# Altium schematic sheet Controller.SchDoc
size OrCAD A; SheetNumber: 4; SheetTotal: 4
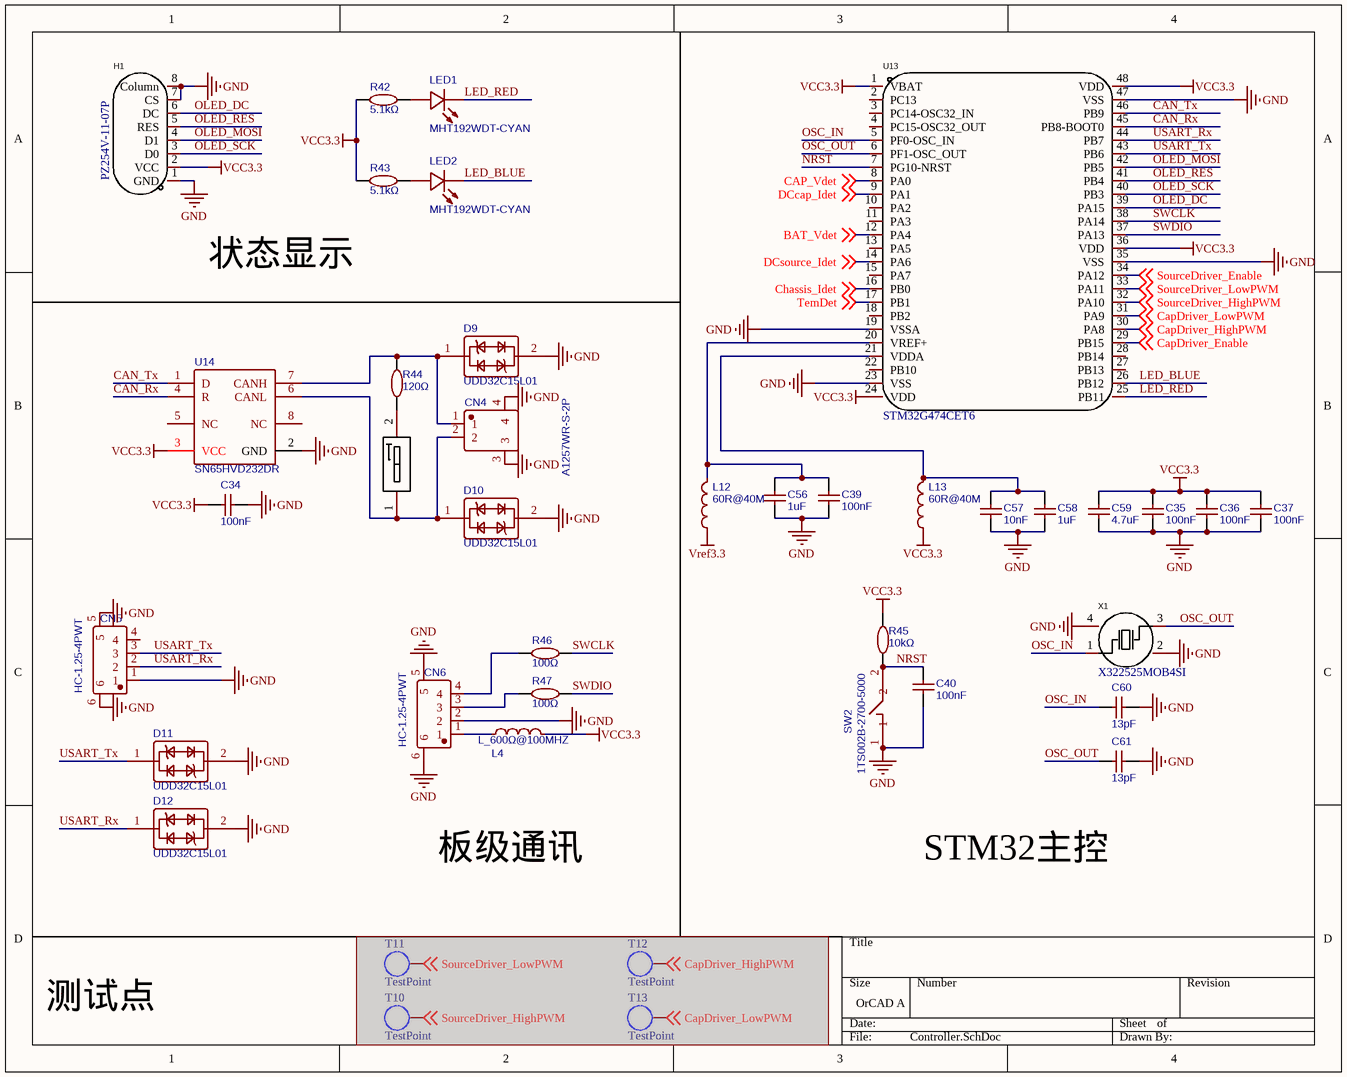
[diagram p0: Controller.SchDoc]

## Parts
C34  100nF  [C-RAD-0603]
C35  100nF  [C-RAD-0603]
C36  100nF  [C-RAD-0603]
C37  100nF  [C-RAD-0603]
C39  100nF  [C-RAD-0603]
C40  100nF  [C-RAD-0603]
C56  1uF  [C-RAD-0603]
C57  10nF  [C-RAD-0603]
C58  1uF  [C-RAD-0603]
C59  4.7uF  [C-RAD-0805]
C60  13pF  [C-RAD-0603]
C61  13pF  [C-RAD-0603]
CN4  A1257WR-S-2P  [CONN-SMD_A1257WR-S-2P]
CN5  HC-1.25-4PWT  [CONN-SMD_4P-P1.25-HC-1.25-4PWT]
CN6  HC-1.25-4PWT  [CONN-SMD_4P-P1.25-HC-1.25-4PWT]
D9  UDD32C15L01  [SOD-323_L1.8-W1.3-LS2.5-BI]
D10  UDD32C15L01  [SOD-323_L1.8-W1.3-LS2.5-BI]
D11  UDD32C15L01  [SOD-323_L1.8-W1.3-LS2.5-BI]
D12  UDD32C15L01  [SOD-323_L1.8-W1.3-LS2.5-BI]
H1  PZ254V-11-07P  [OLED_13inch]
L4  L_600Ω@100MHZ  [0805-1]
L12  60R@40M  [0603-1]
L13  60R@40M  [0603-1]
LED1  MHT192WDT-CYAN  [LED_0805]
LED2  MHT192WDT-CYAN  [LED_0805]
R42  5.1kΩ  [0603-1]
R43  5.1kΩ  [0603-1]
R44  120Ω  [0603-1]
R45  10kΩ  [0603-1]
R46  100Ω  [0603-1]
R47  100Ω  [0603-1]
SW1  DSHP01TSGET  [SW-SMD_DSHP01TSGET]  (value not drawn)
SW2  1TS002B-2700-5000  [SW_PB2_A1]
T10  TestPoint  [TestPoint]  (masked out: inside a compile mask, not in the netlist)
T11  TestPoint  [TestPoint]  (masked out: inside a compile mask, not in the netlist)
T12  TestPoint  [TestPoint]  (masked out: inside a compile mask, not in the netlist)
T13  TestPoint  [TestPoint]  (masked out: inside a compile mask, not in the netlist)
U13  STM32G474CET6  [LQFP-48_M]
U14  SN65HVD232DR  [SOIC127P610X175-8N]
X1  X322525MOB4SI  [OSC-3225]

## Nets
GND: C34.1 C35.1 C36.1 C37.1 C39.1 C40.1 C56.1 C57.1 C58.1 C59.1 C60.2 C61.2 CN4.3 CN4.4 CN5.1 CN5.5 CN5.6 CN6.2 CN6.5 CN6.6 D9.2 D10.2 D11.2 D12.2 H1.1(GND) H1.7(CS) H1.8(Column) SW2.1 U13.19(VSSA) U13.23(VSS) U13.35(VSS) U13.47(VSS) U14.2(GND) X1.2(GND) X1.4(GND)
VCC3.3: C34.2 C35.2 C36.2 C37.2 C59.2 H1.2(VCC) L4.2 L13.1 R42.2 R43.2 R45.2 U13.1(VBAT) U13.24(VDD) U13.36(VDD) U13.48(VDD) U14.3(VCC)
Vref3.3: L12.1
BAT_Vdet: U13.12(PA4) ; off-sheet BAT_Vdet
CAN_Rx: U13.45(PB8-BOOT0) U14.4(R)
CAN_Tx: U13.46(PB9) U14.1(D)
CAP_Vdet: U13.8(PA0) ; off-sheet CAP_Vdet
CapDriver_Enable: U13.29(PB15) ; off-sheet CapDriver_Enable
CapDriver_HighPWM: U13.30(PA8) ; off-sheet CapDriver_HighPWM
CapDriver_LowPWM: U13.31(PA9) ; off-sheet CapDriver_LowPWM
Chassis_Idet: U13.16(PB0) ; off-sheet Chassis_Idet
DCcap_Idet: U13.9(PA1) ; off-sheet DCcap_Idet
DCsource_Idet: U13.14(PA6) ; off-sheet DCsource_Idet
LED_BLUE: LED2.2(K) U13.26(PB12)
LED_RED: LED1.2(K) U13.25(PB11)
NRST: C40.2 R45.1 SW2.2 U13.7(PG10-NRST)
OLED_DC: H1.6(DC) U13.39(PA15)
OLED_MOSI: H1.4(D1) U13.42(PB5)
OLED_RES: H1.5(RES) U13.41(PB4)
OLED_SCK: H1.3(D0) U13.40(PB3)
OSC_IN: C60.1 U13.5(PF0-OSC_IN) X1.1(OSC1)
OSC_OUT: C61.1 U13.6(PF1-OSC_OUT) X1.3(OSC2)
SourceDriver_Enable: U13.34(PA12) ; off-sheet SourceDriver_Enable
SourceDriver_HighPWM: U13.32(PA10) ; off-sheet SourceDriver_HighPWM
SourceDriver_LowPWM: U13.33(PA11) ; off-sheet SourceDriver_LowPWM
SWCLK: R46.2 U13.38(PA14)
SWDIO: R47.2 U13.37(PA13)
TemDet: U13.17(PB1) ; off-sheet TemDet
USART_Rx: CN5.2 D12.1 U13.44(PB7)
USART_Tx: CN5.3 D11.1 U13.43(PB6)
NetC39_2: C39.2 C56.2 L12.2 U13.20(VREF+)
NetC57_2: C57.2 C58.2 L13.2 U13.21(VDDA)
NetCN4_1: CN4.1 D9.1 R44.2 U14.7(CANH)
NetCN4_2: CN4.2 D10.1 SW1.1(A1) U14.6(CANL)
NetCN6_1: CN6.1 L4.1
NetCN6_3: CN6.3 R47.1
NetCN6_4: CN6.4 R46.1
NetLED1_1: LED1.1(A) R42.1
NetLED2_1: LED2.1(A) R43.1
NetR44_1: R44.1 SW1.2(B1)

Not connected (* = marked no-connect by the designer): CN5 4; U13 2(PC13) 3(PC14-OSC32_IN) 4(PC15-OSC32_OUT) 10(PA2) 11(PA3) 13(PA5) 15(PA7) 18(PB2) 22(PB10) 27(PB13) 28(PB14); U14 5(NC) 8(NC)

## Notes on the sheet
- 状态显示
- 板级通讯
- STM32主控
- 测试点

## Library data of the parts
C34-C37 C39 C40 = 100nF: BOM_Manufacturer: Guangdong Fenghua Advanced Tech; BOM_Manufacturer Part: 0805CG330J500NT; nameAlias: Capacitance; Contributor: LCSC; BOM_Supplier: LCSC; BOM_Supplier Part: C157687; BOM_JLCPCB Part Class: Extended Part; spicePre: C; spiceSymbolName: 0805CG330J500NT
C56 C58 = 1uF: BOM_Manufacturer: Guangdong Fenghua Advanced Tech; BOM_Manufacturer Part: 0805CG330J500NT; nameAlias: Capacitance; Contributor: LCSC; BOM_Supplier: LCSC; BOM_Supplier Part: C157687; BOM_JLCPCB Part Class: Extended Part; spicePre: C; spiceSymbolName: 0805CG330J500NT
C57 = 10nF: BOM_Manufacturer: Guangdong Fenghua Advanced Tech; BOM_Manufacturer Part: 0805CG330J500NT; nameAlias: Capacitance; Contributor: LCSC; BOM_Supplier: LCSC; BOM_Supplier Part: C157687; BOM_JLCPCB Part Class: Extended Part; spicePre: C; spiceSymbolName: 0805CG330J500NT
C59 = 4.7uF: BOM_Manufacturer: Guangdong Fenghua Advanced Tech; BOM_Manufacturer Part: 0805CG330J500NT; nameAlias: Capacitance; Contributor: LCSC; BOM_Supplier: LCSC; BOM_Supplier Part: C157687; BOM_JLCPCB Part Class: Extended Part; spicePre: C; spiceSymbolName: 0805CG330J500NT
C60 C61 = 13pF: BOM_Manufacturer: Guangdong Fenghua Advanced Tech; BOM_Manufacturer Part: 0805CG330J500NT; nameAlias: Capacitance; Contributor: LCSC; BOM_Supplier: LCSC; BOM_Supplier Part: C157687; BOM_JLCPCB Part Class: Extended Part; spicePre: C; spiceSymbolName: 0805CG330J500NT
CN4 = A1257WR-S-2P: BOM_Manufacturer: Changjiang Connectors; Contributor: LCSC; BOM_Supplier: LCSC; BOM_Supplier Part: C225125; BOM_Manufacturer Part: A1257WR-S-2P; BOM_JLCPCB Part Class: Extended Part; spicePre: C; spiceSymbolName: A1257WR-S-2P
CN5 CN6 = HC-1.25-4PWT: BOM_Manufacturer: HCTL(华灿天禄); Contributor: LCSC; BOM_Supplier: LCSC; BOM_Supplier Part: C2845381; BOM_Manufacturer Part: HC-1.25-4PWT; BOM_JLCPCB Part Class: Extended Part; spicePre: C; spiceSymbolName: HC-1.25-4PWT
D9-D12 = UDD32C15L01: BOM_Manufacturer: Brightking Elec (TAIWAN); Contributor: LCSC; BOM_Supplier: LCSC; BOM_Supplier Part: C313321; BOM_Manufacturer Part: UDD32C15L01; BOM_JLCPCB Part Class: Extended Part; spicePre: D; spiceSymbolName: UDD32C15L01
H1 = OLED_1.3inch: Manufacturer: XFCN(兴飞); Add into BOM: yes; Pitch: 2.54mm; Pin Structure: 1x7P; Circluar Pins/Square Pins: 方针; Name: PZ254V-11-07P; Symbol: PZ254V-11-07P; Device: PZ254V-11-07P; LCSC Part Name: 2.54mm 1x7P 直插 方针; Supplier Part: C492406; Manufacturer Part: PZ254V-11-07P; Supplier Footprint: 直插,P=2.54mm; JLCPCB Part Class: Extended Part; Datasheet: https://atta.szlcsc.com/upload/public/pdf/source/20200309/C492406_654C533EE691117E22DD9F76C114C2D9.pdf; Supplier: LCSC; Convert to PCB: yes; Number of Pins: 7; Number of Rows: 1; Row Spacing: -; Mounting Type: 直插; Current Rating (Max): -; Voltage Rating (Max): -; Length of Mating Pin: 6mm; Insulation Height: 2.5mm; Length of End Connection Pin: 3mm; Contact Material: 黄铜; Contact Plating: -; Operating Temperature Range: -40℃~+105℃; Color: 黑色
L4 = L_600Ω@100MHZ: BOM_Manufacturer: FH; BOM_Manufacturer Part: CBW201209U601T; nameAlias: Value; BOM_Supplier: LCSC; BOM_Supplier Part: C21286; BOM_JLCPCB Part Class: Extended Part; spicePre: L; spiceSymbolName: CBW201209U601T
L12 L13 = 60R@40M: BOM_Manufacturer: FH; BOM_Manufacturer Part: CBW201209U601T; nameAlias: Value; BOM_Supplier: LCSC; BOM_Supplier Part: C21286; BOM_JLCPCB Part Class: Extended Part; spicePre: L; spiceSymbolName: CBW201209U601T
LED1 LED2 = MHT192WDT-CYAN: BOM_Manufacturer: MEIHUA; Contributor: LCSC; BOM_Supplier: LCSC; BOM_Supplier Part: C496821; BOM_Manufacturer Part: MHT192WDT-CYAN; BOM_JLCPCB Part Class: Extended Part; spicePre: L; spiceSymbolName: MHT192WDT-CYAN
R42 R43 = 5.1kΩ: BOM_Manufacturer: UniOhm; BOM_Manufacturer Part: 0603WAF1002T5E; nameAlias: Resistance; Resistance (Ohms): 10K; BOM_Supplier: LCSC; BOM_Supplier Part: C25804; BOM_JLCPCB Part Class: Basic Part; spicePre: R; spiceSymbolName: 0603WAF1002T5E
R44 = 120Ω: BOM_Manufacturer: UniOhm; BOM_Manufacturer Part: 0603WAF1002T5E; nameAlias: Resistance; Resistance (Ohms): 10K; BOM_Supplier: LCSC; BOM_Supplier Part: C25804; BOM_JLCPCB Part Class: Basic Part; spicePre: R; spiceSymbolName: 0603WAF1002T5E
R45 = 10kΩ: BOM_Manufacturer: UniOhm; BOM_Manufacturer Part: 0603WAF1002T5E; nameAlias: Resistance; Resistance (Ohms): 10K; BOM_Supplier: LCSC; BOM_Supplier Part: C25804; BOM_JLCPCB Part Class: Basic Part; spicePre: R; spiceSymbolName: 0603WAF1002T5E
R46 R47 = 100Ω: BOM_Manufacturer: UniOhm; BOM_Manufacturer Part: 0603WAF1002T5E; nameAlias: Resistance; Resistance (Ohms): 10K; BOM_Supplier: LCSC; BOM_Supplier Part: C25804; BOM_JLCPCB Part Class: Basic Part; spicePre: R; spiceSymbolName: 0603WAF1002T5E
SW1 = DSHP01TSGET: Manufacturer: YE; Add into BOM: yes; Circuit: 单刀单掷; Number of Positions: 1; Name: DSHP01TSGET; Symbol: DSHP01TSGET; Device: DSHP01TSGET; LCSC Part Name: 1.27mm 1位低推贴胶; Supplier Part: C126848; Manufacturer Part: DSHP01TSGET; Supplier Footprint: SMD,5.4x2.85mm; JLCPCB Part Class: Extended Part; Datasheet: https://atta.szlcsc.com/upload/public/pdf/source/20220428/74B573882803886B9DF6FBBC1614692A.pdf; Supplier: LCSC; Convert to PCB: yes; Type: 平拨，凹槽式; Lead Pitch: 1.27mm; Color: 黑色
SW2 = 1TS002B-2700-5000: BOM_Manufacturer: HYP; Contributor: LCSC; BOM_Supplier: LCSC; BOM_Supplier Part: C318844; BOM_Manufacturer Part: 1TS002B-2700-5000; BOM_JLCPCB Part Class: Extended Part; spicePre: S; spiceSymbolName: 1TS002B-2700-5000
U13 = STM32G474CET6: Manufacturer: ST(意法半导体); Add into BOM: yes; CPU Core: ARM Cortex-M4; CPU Maximum Speed: 170MHz; Operating Voltage Range: 1.71V~3.6V; Program Storage Size: 512KB; Program Memory Type: FLASH; RAM Size: 128KB; GPIO Ports Number: 38; ADC (Bit): 12bit; Peripheral/Function: PWM；看门狗；PWM; Internal Oscillator: 有; Name: STM32G474CET6; Symbol: STM32G474CET6; Device: STM32G474CET6; LCSC Part Name: ARM Cortex-M4 170MHz; Supplier Part: C730125; Manufacturer Part: STM32G474CET6; Supplier Footprint: LQFP-48(7x7); JLCPCB Part Class: Extended Part; Datasheet: https://atta.szlcsc.com/upload/public/pdf/source/20200902/C431632_38212262685EE30B1989689374F08940.pdf; Supplier: LCSC; Convert to PCB: yes; EEPROM: 512KB; DAC (Bit): 12bit; PWM (Bit): -; Universal Serial Bus: -; Internal Comparator: -; communication protocol: -; Watchdog: -; Real-Time Clock: -; Infrared Data Association: -; Low-Voltage Detect: -; CCP Capture/Compare: -; Secure Digital Input and Output: -; Direct Memory Access: -; Operating Temperature Range: -40℃~+85℃
U14 = SN65HVD232DR: BOM_Manufacturer: TI; BOM_Supplier: LCSC; BOM_Manufacturer Part: SN65HVD232DR; BOM_Supplier Part: C30530; BOM_JLCPCB Part Class: Extended Part; spicePre: U; spiceSymbolName: SN65HVD232DR
X1 = X322525MOB4SI: Manufacturer: YXC(扬兴晶振); Name: 25MHz; Add into BOM: yes; Crystal Type: 贴片无源晶振; Value: 25MHz; Frequency Tolerance: ±10ppm; Frequency Stability: ±30ppm; Load Capacitance: 12pF; Symbol: X322525MOB4SI; Device: X322525MOB4SI; LCSC Part Name: 25MHz ±10ppm 12pF; Supplier Part: C9006; Manufacturer Part: X322525MOB4SI; Supplier Footprint: SMD3225-4P; JLCPCB Part Class: Basic Part; Datasheet: https://atta.szlcsc.com/upload/public/pdf/source/20210329/C112971_1F611BDC486E193C1706F6D8EB5AA189.pdf; Supplier: LCSC; Convert to PCB: yes; Operating Temperature: -40℃~+85℃